# Altium schematic sheet extBoard_sheet2_acc.SchDoc: EXT BOARD - Accelerometer
size A4; Revision: 0.1.0; SheetNumber: 2; SheetTotal: 5; Author: NALO; DrawnBy: NALO; DocumentSize: A4; PCAName: EXT BOARD; ProjectName: Bachelor's Thesis
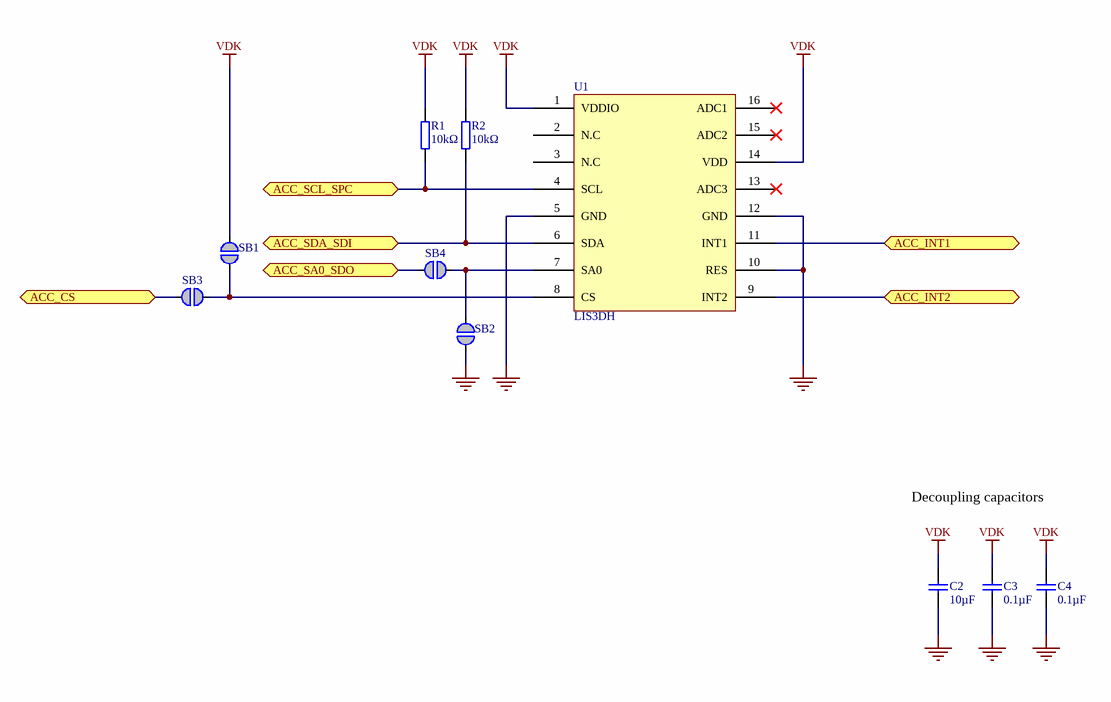
[diagram p0: extBoard_sheet2_acc.SchDoc]

## Parts
C2  10µF  [CAPC2012X11L]
C3  0.1µF  [CAPC2012X11L]
C4  0.1µF  [CAPC2012X11L]
R1  10kΩ  [R0805]
R2  10kΩ  [R0805]
SB1  Solderbridge  [Solderbridge]  (value not drawn)  (no BOM)
SB2  Solderbridge  [Solderbridge]  (value not drawn)  (no BOM)
SB3  Solderbridge  [Solderbridge]  (value not drawn)  (no BOM)
SB4  Solderbridge  [Solderbridge]  (value not drawn)  (no BOM)
U1  LIS3DH  [LGA-16 (3x3x1.0mm)]

## Ports
ACC_CS (bidir), ACC_INT1 (bidir), ACC_INT2 (bidir), ACC_SA0_SDO (bidir), ACC_SCL_SPC (bidir), ACC_SDA_SDI (bidir)

## Nets
GND: C2.1 C3.1 C4.1 SB2.2 U1.5(GND) U1.10(RES) U1.12(GND)
VDK: C2.2 C3.2 C4.2 R1.2 R2.2 SB1.1 U1.1(VDDIO) U1.14(VDD)
ACC_CS: SB3.2 ; port ACC_CS
ACC_INT1: U1.11(INT1) ; port ACC_INT1
ACC_INT2: U1.9(INT2) ; port ACC_INT2
ACC_SA0_SDO: SB4.1 ; port ACC_SA0_SDO
ACC_SCL_SPC: R1.1 U1.4(SCL) ; port ACC_SCL_SPC
ACC_SDA_SDI: R2.1 U1.6(SDA) ; port ACC_SDA_SDI
NetSB1_2: SB1.2 SB3.1 U1.8(CS)
NetSB2_1: SB2.1 SB4.2 U1.7(SA0)

Not connected (* = marked no-connect by the designer): U1 2(N.C) 3(N.C) 13(ADC3)* 15(ADC2)* 16(ADC1)*

## Notes on the sheet
- Decoupling capacitors
- Title
- Size
- Date:
- Project Number
- Sheet         of
- Revision
- File:
- Drawn By:

## Library data of the parts
C2-C4 = CAP_0805: Capacitor, X5R, ±10%; Part Number: C0805-4µ7; Note: 16V; Artikkelnr Noca: 20039266; Artikkelnr Simpro: N.A.; Manufacturer: *; Manufacturer Part Number: *; Datasheet: *; Footprint Doc: 0805; LatestRevisionDate: 2013-06-04; Pin Count: 2; Publisher: Nordic Semiconductor; Published: 2009-08-21; Supplier: *; Supplier part number: *; 2nd source Supplier: *; 2nd source part number: *
  C2: Value: 10µF
  C3 C4: Value: 0.1µF
R1 R2 = R0805: Value: 10kΩ
SB1-SB4 = SOLDERBRIDGE: Artikkelnr Noca: N.A.; Part Number: Solderbridge; Manufacturer: *; Manufacturer Part Number: *; Datasheet: *; LatestRevisionDate: 2009-12-14; Pin Count: 2; Publisher: Nordic Semiconductor; Published: 2009-12-14; Value: Solderbridge; Note: *; Supplier: *; Supplier part number: *; 2nd source Supplier: *; 2nd source part number: *; Footprint Doc: Solderbridge; Artikkelnr Simpro: N.A.